# EAGLE schematic Two_transistor_oscillator (EAGLE 8.4.0)
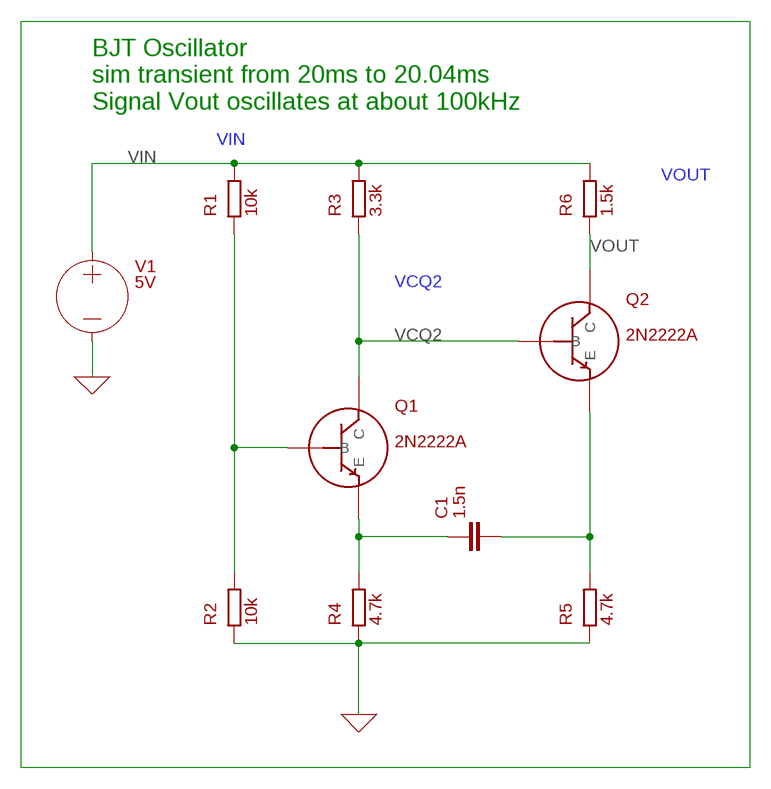
[diagram p0: schematic, sheet 1]

## Parts
C1  1.5n  C  (no package)
Q1  BJT_NPN  (no package)
Q2  BJT_NPN  (no package)
R1  10k  R  (no package)
R2  10k  R  (no package)
R3  3.3k  R  (no package)
R4  4.7k  R  (no package)
R5  4.7k  R  (no package)
R6  1.5k  R  (no package)
V1  5V  VOLTAGE  (no package)

## Nets
0: R2.1 R4.1 R5.1 V1.- ; supply symbol labelled GND
N$1: Q1.B R1.1 R2.2
N$3: C1.1 Q1.E R4.2
N$4: C1.2 Q2.E R5.2
VCQ2: Q1.C Q2.B R3.1
VIN: R1.2 R3.2 R6.2 V1.+
VOUT: Q2.C R6.1

## Notes on the sheet
- BJT Oscillator
  sim transient from 20ms to 20.04ms 
  Signal Vout oscillates at about 100kHz

## Library data of the parts
C1 = ngspice-simulation:C: CAPACITOR; SPICEINITCOND: 1V
Q1 Q2 = ngspice-simulation:BJT_NPN: Bipolar NPN Transistor; SPICEMODEL: 2N2222A; SPICEPREFIX: Q
R1-R6 = ngspice-simulation:R: RESISTOR
V1 = ngspice-simulation:VOLTAGE: Independent Voltage Source, either DC, AC, PULSE, SINE, PWL, EXP, or SFFM; VALUE: 0V